# Altium schematic sheet LED.SchDoc
size A4
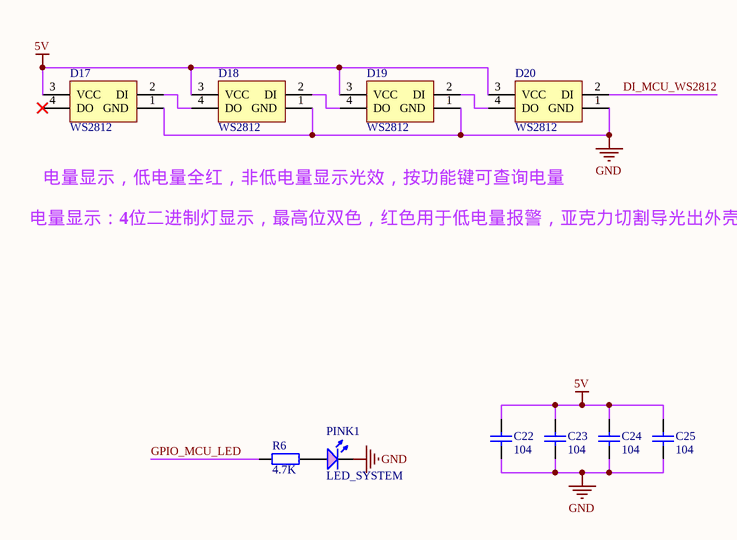
[diagram p0: LED.SchDoc]

## Parts
C22  104  [Cap-0603]
C23  104  [Cap-0603]
C24  104  [Cap-0603]
C25  104  [Cap-0603]
D17  WS2812  [RGB_LED_1206]
D18  WS2812  [RGB_LED_1206]
D19  WS2812  [RGB_LED_1206]
D20  WS2812  [RGB_LED_1206]
PINK1  LED_SYSTEM  [LED_0603_R]
R6  4.7K  [Res-0603]

## Nets
5V: C22.2 C23.2 C24.2 C25.2 D17.3(VCC) D18.3(VCC) D19.3(VCC) D20.3(VCC)
GND: C22.1 C23.1 C24.1 C25.1 D17.1(GND) D18.1(GND) D19.1(GND) D20.1(GND) PINK1.2(K)
DI_MCU_WS2812: D20.2(DI)
GPIO_MCU_LED: R6.2
NetD17_2: D17.2(DI) D18.4(DO)
NetD18_2: D18.2(DI) D19.4(DO)
NetD19_2: D19.2(DI) D20.4(DO)
NetPINK1_1: PINK1.1(A) R6.1

Not connected (* = marked no-connect by the designer): D17 4(DO)*

## Notes on the sheet
- 电量显示，低电量全红，非低电量显示光效，按功能键可查询电量
- 电量显示：4位二进制灯显示，最高位双色，红色用于低电量报警，亚克力切割导光出外壳，为了易看放于朝向人那面
- Title
- Size:
- Date:
- A4
- Number:
- Time:
- Revision:
- Sheet
- of
- File:

## Library data of the parts
C22-C25 = CAP: 贴片陶瓷电容
PINK1 = LED_SMD_PINK: 发光二极管; ComponentLink1Description: 供应商链接; ComponentLink1URL: http://www.szlcsc.com/product/details_2659.html; Package: 0603; Supplier: LC; SuppliersPartNumber: C2286
R6 = RES: 贴片电阻
D17-D20 = WS2812: Publisher: mazhongwei; Published: 8-August-2017; PackageReference: RGB_LED_5050